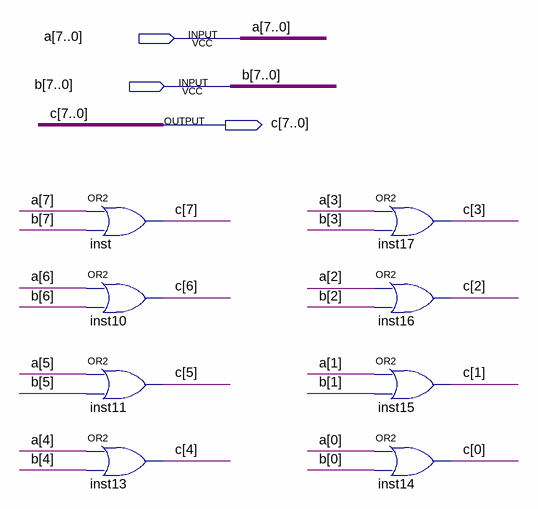
[diagram p0: schematic sheet]
// Quartus schematic or8bit.bdf as structural Verilog: 8 symbols, 3 pins
module or8bit (
  input  [7:0] a,
  input  [7:0] b,
  output [7:0] c
);

  or inst (c[7], a[7], b[7]);
  or inst10 (c[6], a[6], b[6]);
  or inst11 (c[5], a[5], b[5]);
  or inst13 (c[4], a[4], b[4]);
  or inst17 (c[3], a[3], b[3]);
  or inst16 (c[2], a[2], b[2]);
  or inst15 (c[1], a[1], b[1]);
  or inst14 (c[0], a[0], b[0]);
endmodule
